# Altium project pk2.PrjPcb
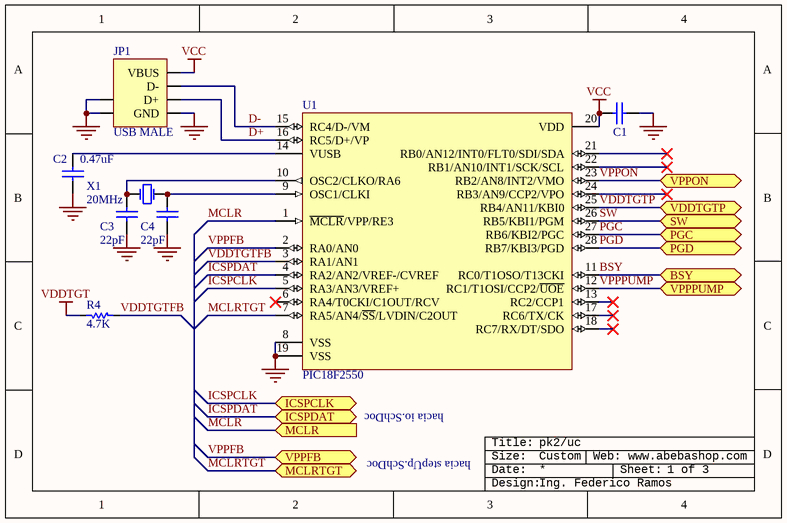
[diagram p0: uc.SchDoc]
3 sheets, 40 parts. Net scope: flat (ports and power ports of the same name join across sheets).
Board file: pk2.PcbDoc
Sheets:
  uc.SchDoc
  io.SchDoc
  stepUp.SchDoc

## Sheet uc.SchDoc: Pickit 2
size 146 x 96 mm; SheetNumber: 1; SheetTotal: 3; PageSetup: Record=PageOptions|CenterHorizontal=True|CenterVertical=True|PrintScale=1.88|XCorrection=1.00|YCorrection=1.00|PrintKind=0|BorderSize=5000000|LeftOffset=0|BottomOffset=0|Orientation=2|PaperLength=1000|PaperWidth=1000|Scale=100|PaperSource=7|PrintQuality=-4|MediaType=1|DitherType=10|PaperKind=Letter|PrintScaleMode=1

### Parts
(Parts that share a designator on the sheet are numbered #1, #2 ... from top to bottom, then left to right.)
C1  Cap  [1206NP]  (value not drawn)
C2  value 0.47uF  [1206NP]  (hidden comment: Cap)
C3  value 22pF  [1206NP]  (hidden comment: Cap)
C4  value 22pF  [1206NP]  (hidden comment: Cap)
JP1  USB MALE  [USB_A_MALE]
R4  value 4.7K  [1206NP]  (hidden comment: Res)
ROT?#1  Rotulo  (value not drawn)  (graphical)
U1  PIC18F2550  [soic28]
X1  value 20MHz  [XTAL1]  (hidden comment: XTAL)

### Ports
BSY (bidir), ICSPCLK (bidir), ICSPDAT (bidir), MCLR (in), MCLRTGT (bidir), PGC (bidir), PGD (bidir), SW (bidir), VDDTGTP (bidir), VPPFB (bidir), VPPON (bidir), VPPPUMP (bidir)

### Nets
GND: C1.1 C2.1 C3.1 C4.2 JP1.4(GND) JP1.5 JP1.6 U1.8(VSS) U1.19(VSS)
VCC: C1.2 JP1.1(VBUS) U1.20(VDD)
VDDTGT: R4.2
BSY: U1.11(RC0/T1OSO/T13CKI) ; port BSY
D+: JP1.3(D+) U1.16(RC5/D+/VP)
D-: JP1.2(D-) U1.15(RC4/D-/VM)
ICSPCLK: U1.5(RA3/AN3/VREF+) ; port ICSPCLK
ICSPDAT: U1.4(RA2/AN2/VREF-/CVREF) ; port ICSPDAT
MCLR: U1.1(~{MCLR}/VPP/RE3) ; port MCLR
MCLRTGT: U1.7(RA5/AN4/~{SS}/LVDIN/C2OUT) ; port MCLRTGT
PGC: U1.27(RB6/KBI2/PGC) ; port PGC
PGD: U1.28(RB7/KBI3/PGD) ; port PGD
SW: U1.26(RB5/KBI1/PGM) ; port SW
VDDTGTFB: R4.1 U1.3(RA1/AN1)
VDDTGTP: U1.25(RB4/AN11/KBI0) ; port VDDTGTP
VPPFB: U1.2(RA0/AN0) ; port VPPFB
VPPON: U1.23(RB2/AN8/INT2/VMO) ; port VPPON
VPPPUMP: U1.12(RC1/T1OSI/CCP2/~{UOE}) ; port VPPPUMP
NetC2_2: C2.2 U1.14(VUSB)
NetC3_2: C3.2 U1.10(OSC2/CLKO/RA6) X1.1(OSC1)
NetC4_1: C4.1 U1.9(OSC1/CLKI) X1.2(OSC2)

Not connected (* = marked no-connect by the designer): U1 6(RA4/T0CKI/C1OUT/RCV)* 13(RC2/CCP1)* 17(RC6/TX/CK)* 18(RC7/RX/DT/SDO)* 21(RB0/AN12/INT0/FLT0/SDI/SDA)* 22(RB1/AN10/INT1/SCK/SCL)* 24(RB3/AN9/CCP2/VPO)*

### Notes on the sheet
- hacia io.SchDoc
- hacia stepUp.SchDoc
- pk2/uc
- Custom
- (near ROT?#1) 1 of 3
- Ing. Federico Ramos
- (in symbol Rotulo) Title:; Size:; Web: www.abebashop.com; Date:; Sheet:; Design:

### Library data of the parts
C1 = Cap: Capacitor; Voltage: 50V; Value: 100nF; Price: 0.25; Technology: Ceramic
C2-C4 = Cap: Capacitor; Voltage: 50V; Price: 0.25; Technology: Ceramic
JP1 = USB: USB Connector; Price: ?
R4 = Res: Resistor; Power: 0.25W; Price: 0.036
ROT?#1 = Rotulo: Rotulo [consolas]
U1 = PIC18F2550: Enhanced FLASH Microcontroller
X1 = XTAL: Crystal Oscillator; Price: ?

## Sheet io.SchDoc: Pickit 2
size 146 x 96 mm; SheetNumber: 2; SheetTotal: 3; PageSetup: Record=PageOptions|CenterHorizontal=True|CenterVertical=True|PrintScale=2.00|XCorrection=1.00|YCorrection=1.00|PrintKind=0|BorderSize=5000000|LeftOffset=0|BottomOffset=0|Orientation=2|PaperLength=1000|PaperWidth=1000|Scale=100|PaperSource=7|PrintQuality=-4|MediaType=1|DitherType=10|PaperKind=A4|PrintScaleMode=1
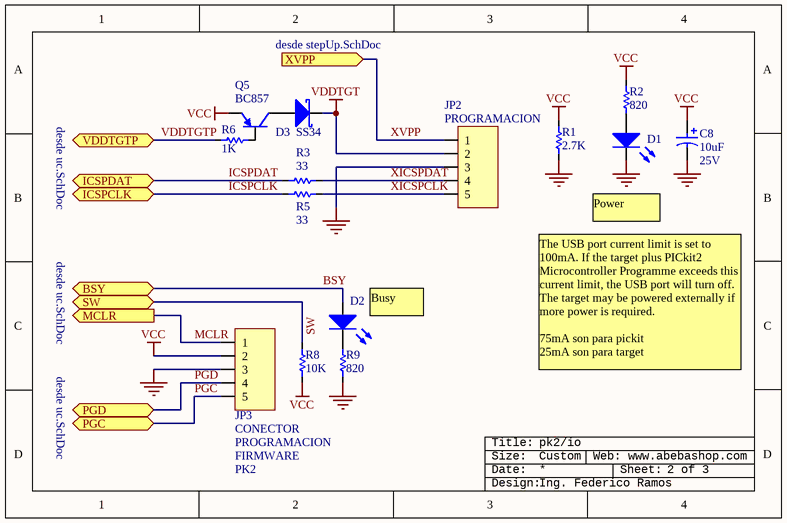
[diagram p1: io.SchDoc]

### Parts
(Parts that share a designator on the sheet are numbered #1, #2 ... from top to bottom, then left to right.)
C8  value 10uF  Voltaje: 25V  [1206P]  (hidden comment: Cap Pol)
D1  LED  [1206P]  (value not drawn)
D2  LED  [1206P]  (value not drawn)
D3  SS34  [D64]
JP2  Price: PROGRAMACION  [HDR5x1]  (hidden comment: Header5x1)
JP3  Price: CONECTOR  [HDR5x1]  (hidden comment: Header5x1)
Q5  BC857  [SOT23]
R1  value 2.7K  [1206NP]  (hidden comment: Res)
R2  value 820  [1206NP]  (hidden comment: Res)
R3  value 33  [1206NP]  (hidden comment: Res)
R5  value 33  [1206NP]  (hidden comment: Res)
R6  value 1K  [1206NP]  (hidden comment: Res)
R8  value 10K  [1206NP]  (hidden comment: Res)
R9  value 820  [1206NP]  (hidden comment: Res)
ROT?#2  Rotulo  (value not drawn)  (graphical)

### Ports
BSY (bidir), ICSPCLK (bidir), ICSPDAT (bidir), MCLR (out), PGC (bidir), PGD (bidir), SW (bidir), VDDTGTP (bidir), XVPP (in)

### Nets
GND: C8.2 D1.2(K) JP2.3 JP3.3 R1.2 R9.1
VCC: C8.1 JP3.2 Q5.3(E) R1.1 R2.2 R8.2
VDDTGT: D3.2(K) JP2.2
BSY: D2.1(A) ; port BSY
ICSPCLK: R5.1 ; port ICSPCLK
ICSPDAT: R3.1 ; port ICSPDAT
MCLR: JP3.1 ; port MCLR
PGC: JP3.5 ; port PGC
PGD: JP3.4 ; port PGD
SW: R8.1 ; port SW
VDDTGTP: R6.2 ; port VDDTGTP
XICSPCLK: JP2.5 R5.2
XICSPDAT: JP2.4 R3.2
XVPP: JP2.1 ; port XVPP
NetD1_1: D1.1(A) R2.1
NetD2_2: D2.2(K) R9.2
NetD3_1: D3.1(A) Q5.1(C)
NetQ5_2: Q5.2(B) R6.1

### Notes on the sheet
- desde stepUp.SchDoc
- desde uc.SchDoc
- Power
- Busy
- The USB port current limit is set to 100mA. If the target plus PICkit2 Microcontroller Programme exceeds this current limit, the USB port will turn off. The target may be powered externally if more power is required.
  75mA son para pickit
  25mA son para target
- pk2/io
- Custom
- (near ROT?#2) 2 of 3
- Ing. Federico Ramos
- (in symbol Header5x1) PROGRAMACION; FIRMWARE; PK2
- (in symbol Rotulo) Title:; Size:; Web: www.abebashop.com; Date:; Sheet:; Design:

### Library data of the parts
C8 = Cap Pol: Capacitor Polarizado; Price: ?
D1 D2 = LED: Color: Green; Price: ?
D3 = 1N5822: Schottky Diode 3A 40V; Revision: July-2002: Re-released for DXP Platform.
JP2 JP3 = Header5x1: Header 5x1
Q5 = BC856A: 100mA 65V PNP Bipolar Transistor; pin to pad: 1>3 2>1 3>2; Price: 0.3267
R1-R3 R5 R6 R8 R9 = Res: Resistor; Power: 0.25W; Price: 0.036
ROT?#2 = Rotulo: Rotulo [consolas]

## Sheet stepUp.SchDoc: Pickit 2
size 146 x 96 mm; SheetNumber: 3; SheetTotal: 3; PageSetup: Record=PageOptions|CenterHorizontal=True|CenterVertical=True|PrintScale=2.00|XCorrection=1.00|YCorrection=1.00|PrintKind=0|BorderSize=5000000|LeftOffset=0|BottomOffset=0|Orientation=2|PaperLength=1000|PaperWidth=1000|Scale=100|PaperSource=7|PrintQuality=-4|MediaType=1|DitherType=10|PaperKind=A4|PrintScaleMode=1
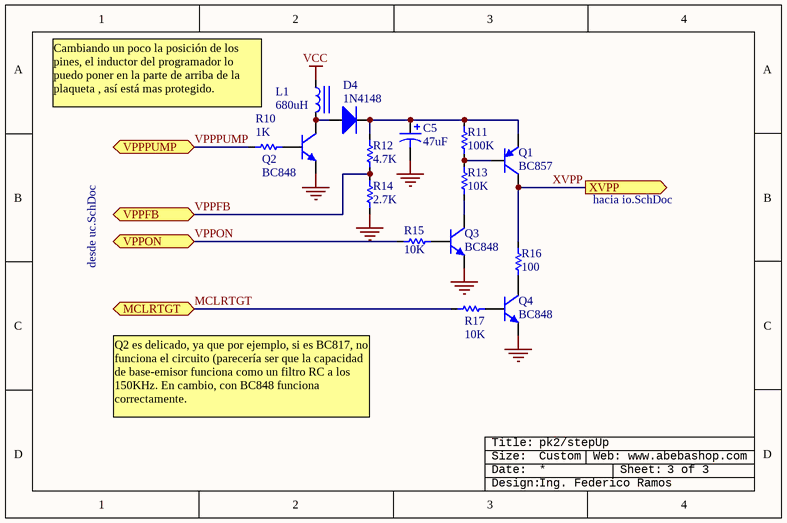
[diagram p2: stepUp.SchDoc]

### Parts
(Parts that share a designator on the sheet are numbered #1, #2 ... from top to bottom, then left to right.)
C5  47uF  [D]
D4  1N4148  [DSMD1MM]
L1  value 680uH  [RES300TH]
Q1  BC857  [SOT23]
Q2  BC848  [SOT23]
Q3  BC848  [SOT23]
Q4  BC848  [SOT23]
R10  value 1K  [1206NP]  (hidden comment: Res)
R11  value 100K  [1206NP]  (hidden comment: Res)
R12  value 4.7K  [1206NP]  (hidden comment: Res)
R13  value 10K  [1206NP]  (hidden comment: Res)
R14  value 2.7K  [1206NP]  (hidden comment: Res)
R15  value 10K  [1206NP]  (hidden comment: Res)
R16  value 100  [1206NP]  (hidden comment: Res)
R17  value 10K  [1206NP]  (hidden comment: Res)
ROT?#3  Rotulo  (value not drawn)  (graphical)

### Ports
MCLRTGT (bidir), VPPFB (bidir), VPPON (bidir), VPPPUMP (bidir), XVPP (out)

### Nets
GND: C5.2 Q2.3(E) Q3.3(E) Q4.3(E) R14.1
VCC: L1.1
MCLRTGT: R17.2 ; port MCLRTGT
VPPFB: R12.1 R14.2 ; port VPPFB
VPPON: R15.2 ; port VPPON
VPPPUMP: R10.2 ; port VPPPUMP
XVPP: Q1.1(C) R16.2 ; port XVPP
NetC5_1: C5.1 D4.2 Q1.3(E) R11.2 R12.2
NetD4_1: D4.1 L1.2 Q2.1(C)
NetQ1_2: Q1.2(B) R11.1 R13.2
NetQ2_2: Q2.2(B) R10.1
NetQ3_1: Q3.1(C) R13.1
NetQ3_2: Q3.2(B) R15.1
NetQ4_1: Q4.1(C) R16.1
NetQ4_2: Q4.2(B) R17.1

### Notes on the sheet
- Cambiando un poco la posición de los pines, el inductor del programador lo puedo poner en la parte de arriba de la plaqueta , así está mas protegido.
- hacia io.SchDoc
- desde uc.SchDoc
- Q2 es delicado, ya que por ejemplo, si es BC817, no funciona el circuito (parecería ser que la capacidad de base-emisor funciona como un filtro RC a los 150KHz. En cambio, con BC848 funciona correctamente.
- pk2/stepUp
- Custom
- (near ROT?#3) 3 of 3
- Ing. Federico Ramos
- (in symbol Rotulo) Title:; Size:; Web: www.abebashop.com; Date:; Sheet:; Design:

### Library data of the parts
C5 = T491D: Solid Tantalum Chip Capacitor, Standard T491 Series - Industrial Grade; Value: 100pF; Published: 17-Jul-2002; LatestRevisionDate: 19-Mar-2004; LatestRevisionNote: Silkscreen dimensions re-sized.; DatasheetDocument: Mar-2001; PackageDocument: Mar-2001; PackageReference: D; Publisher: Altium Limited; Code_JEITA: 7343-31; ComponentLink1Description: Manufacturer Link; ComponentLink1URL: http://www.kemet.com/; ComponentLink2Description: Datasheet; ComponentLink2URL: http://www.kemet.com/kemet/web/homepage/kechome.nsf/vapubfilesname/F3102TA.pdf/$file/F3102TA.pdf
D4 = 1N4148: High Conductance Fast Diode; Price: ?
L1 = Inductor: Revision: July-2002: Re-released for DXP Platform.
Q1 = BC856A: 100mA 65V PNP Bipolar Transistor; pin to pad: 1>3 2>1 3>2; Price: 0.3267
Q2-Q4 = BC846A: 100mA 65V NPN Bipolar Transistor; pin to pad: 1>3 2>1 3>2; Price: 0.38
R10-R17 = Res: Resistor; Power: 0.25W; Price: 0.036
ROT?#3 = Rotulo: Rotulo [consolas]

## Nets that join several sheets
GND: uc (9 pins), io (6 pins), stepUp (5 pins)
VCC: uc (C1.2 JP1.1 U1.20), io (6 pins), stepUp (L1.1)
VDDTGT: uc (R4.2), io (D3.2 JP2.2)
BSY: uc (U1.11), io (D2.1)
ICSPCLK: uc (U1.5), io (R5.1)
ICSPDAT: uc (U1.4), io (R3.1)
MCLR: uc (U1.1), io (JP3.1)
MCLRTGT: uc (U1.7), stepUp (R17.2)
PGC: uc (U1.27), io (JP3.5)
PGD: uc (U1.28), io (JP3.4)
SW: uc (U1.26), io (R8.1)
VDDTGTP: uc (U1.25), io (R6.2)
VPPFB: uc (U1.2), stepUp (R12.1 R14.2)
VPPON: uc (U1.23), stepUp (R15.2)
VPPPUMP: uc (U1.12), stepUp (R10.2)
XVPP: io (JP2.1), stepUp (Q1.1 R16.2)